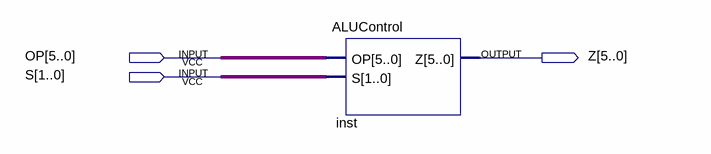
[diagram p0: schematic sheet]
// Quartus schematic ALUControlTest.bdf as structural Verilog: 1 symbols, 3 pins
module ALUControlTest (
  input  [5:0] OP,
  input  [1:0] S,
  output [5:0] Z
);

  ALUControl inst (.OP(OP), .S(S), .Z(Z));
endmodule
